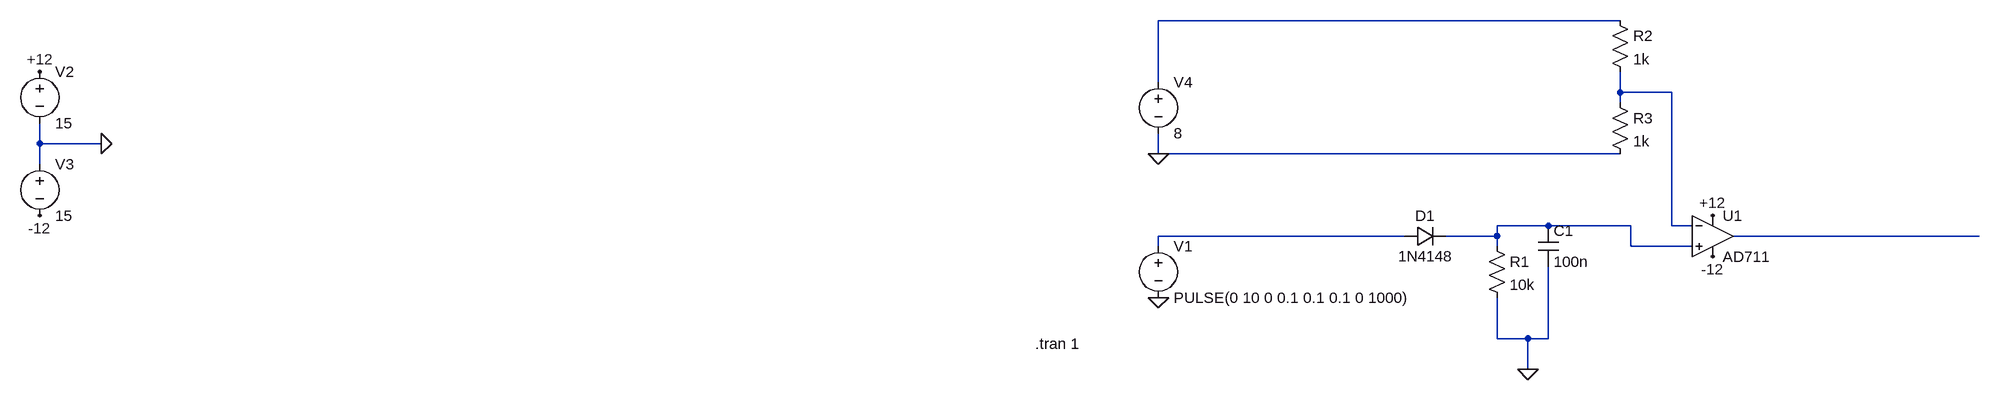
[diagram p0: schematic Montage 7 8 9.asc]
Montage 7 8 9.asc, the LTspice schematic file:
Version 4
SHEET 1 1364 680
WIRE 800 -96 80 -96
WIRE 80 0 80 -96
WIRE 800 16 800 -16
WIRE 880 16 800 16
WIRE 800 32 800 16
WIRE -1664 96 -1664 64
WIRE -1568 96 -1664 96
WIRE 80 112 80 80
WIRE 800 112 80 112
WIRE -1664 128 -1664 96
WIRE 688 224 608 224
WIRE 816 224 688 224
WIRE 880 224 880 16
WIRE 912 224 880 224
WIRE 464 240 80 240
WIRE 608 240 608 224
WIRE 608 240 528 240
WIRE 1360 240 976 240
WIRE 80 256 80 240
WIRE 608 256 608 240
WIRE 816 256 816 224
WIRE 912 256 816 256
WIRE 608 400 608 336
WIRE 656 400 608 400
WIRE 688 400 688 288
WIRE 688 400 656 400
WIRE 656 448 656 400
FLAG -1664 -16 +12
FLAG -1664 208 -12
FLAG -1568 96 0
FLAG 80 336 0
FLAG 944 208 +12
FLAG 944 272 -12
FLAG 656 448 0
FLAG 80 112 0
SYMBOL voltage -1664 112 R0
WINDOW 123 0 0 Left 0
WINDOW 39 0 0 Left 0
SYMATTR InstName V3
SYMATTR Value 15
SYMBOL voltage -1664 -32 R0
WINDOW 123 0 0 Left 0
WINDOW 39 0 0 Left 0
SYMATTR InstName V2
SYMATTR Value 15
SYMBOL voltage 80 240 R0
WINDOW 123 0 0 Left 0
WINDOW 39 0 0 Left 0
SYMATTR InstName V1
SYMATTR Value PULSE(0 10 0 0.1 0.1 0.1 0 1000)
SYMBOL diode 464 256 R270
WINDOW 0 32 32 VTop 2
WINDOW 3 0 32 VBottom 2
SYMATTR InstName D1
SYMATTR Value 1N4148
SYMBOL res 592 240 R0
SYMATTR InstName R1
SYMATTR Value 10k
SYMBOL voltage 80 -16 R0
WINDOW 123 0 0 Left 0
WINDOW 39 0 0 Left 0
SYMATTR InstName V4
SYMATTR Value 8
SYMBOL OpAmps\\AD711 944 176 R0
SYMATTR InstName U1
SYMBOL res 784 -112 R0
SYMATTR InstName R2
SYMATTR Value 1k
SYMBOL res 784 16 R0
SYMATTR InstName R3
SYMATTR Value 1k
SYMBOL cap 672 224 R0
SYMATTR InstName C1
SYMATTR Value 100n
TEXT -112 408 Left 2 !.tran 1

The netlist it stands for:
* Montage 7 8 9.asc
V3 0 -12 15
V2 +12 0 15
V1 N004 0 PULSE(0 10 0 0.1 0.1 0.1 0 1000)
D1 N004 N003 1N4148
R1 N003 0 10k
V4 N001 0 8
XU1 N003 N002 +12 -12 N005 AD712  ; AD711, pins In+ In- V+ V- OUT
R2 N001 N002 1k
R3 N002 0 1k
C1 N003 0 100n
.model D D
.lib standard.dio
.tran 1
.lib ADI1.lib
.backanno
.end